# EAGLE design LPC_4TE_3.42taster2 (EAGLE 5.03)
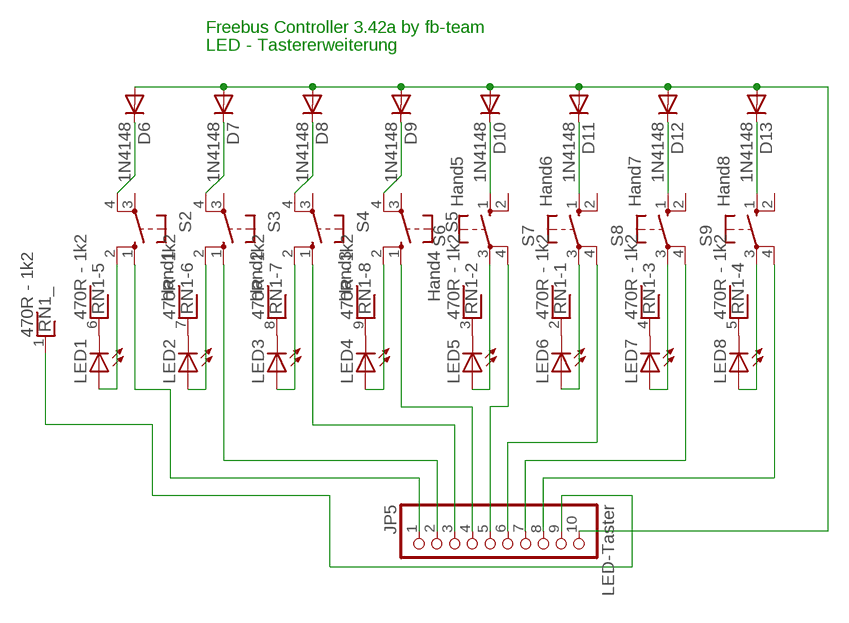
[diagram p0: schematic, sheet 1]

## Parts
D6  1N4148  [DO35-10]
D7  1N4148  [DO35-10]
D8  1N4148  [DO35-10]
D9  1N4148  [DO35-10]
D10  1N4148  [DO35-10]
D11  1N4148  [DO35-10]
D12  1N4148  [DO35-10]
D13  1N4148  [DO35-10]
JP5  LED-Taster  PINHD-1X10  [1X10]
LED1  LED3MM  [LED3MM]
LED2  LED3MM  [LED3MM]
LED3  LED3MM  [LED3MM]
LED4  LED3MM  [LED3MM]
LED5  LED3MM  [LED3MM]
LED6  LED3MM  [LED3MM]
LED7  LED3MM  [LED3MM]
LED8  LED3MM  [LED3MM]
RN1  470R - 1k2  RNX8  [RN-9]
S2  Hand1  10-XX  [B3F-10XX]
S3  Hand2  10-XX  [B3F-10XX]
S4  Hand3  10-XX  [B3F-10XX]
S5  Hand4  10-XX  [B3F-10XX]
S6  Hand5  10-XX  [B3F-10XX]
S7  Hand6  10-XX  [B3F-10XX]
S8  Hand7  10-XX  [B3F-10XX]
S9  Hand8  10-XX  [B3F-10XX]

## Nets
N$1: D6.C S2.4(P1)
N$2: JP5.8 S9.4(P1)
N$3: JP5.7 S8.4(P1)
N$4: D10.C S6.1(S)
N$5: D7.C S3.4(P1)
N$6: D8.C S4.4(P1)
N$7: D9.C S5.4(P1)
N$8: LED1.A S2.2(S1)
N$9: D11.C S7.1(S)
N$10: D12.C S8.1(S)
N$11: D13.C S9.1(S)
N$12: JP5.5 S6.4(P1)
N$13: LED5.K(C) RN1.3
N$14: LED6.K(C) RN1.2
N$15: LED1.K(C) RN1.6
N$16: LED7.K(C) RN1.4
N$17: LED8.K(C) RN1.5
N$18: LED4.K(C) RN1.9
N$19: LED2.K(C) RN1.7
N$20: LED3.K(C) RN1.8
N$21: JP5.6 S7.4(P1)
N$22: LED3.A S4.2(S1)
N$23: LED2.A S3.2(S1)
N$24: LED5.A S6.3(P)
N$25: JP5.9 RN1.1
N$26: LED6.A S7.3(P)
N$29: LED7.A S8.3(P)
N$30: LED8.A S9.3(P)
N$31: LED4.A S5.2(S1)
N$32: JP5.2 S3.1(S)
N$33: JP5.3 S4.1(S)
N$35: JP5.4 S5.1(S)
N$36: D6.A D7.A D8.A D9.A D10.A D11.A D12.A D13.A JP5.10
N$45: JP5.1 S2.1(S)
Unconnected: S2.3(P) S3.3(P) S4.3(P) S5.3(P) S6.2(S1) S7.2(S1) S8.2(S1) S9.2(S1)

## Notes on the sheet
- Freebus Controller 3.42a by fb-team
- LED - Tastererweiterung

## Library data of the parts
D6-D13 = diode:1N4148: DIODE high speed (Philips)
JP5 = pinhead:PINHD-1X10: PIN HEADER
LED1-LED8 = led:LED: LED OSRAM: - CHIPLED LG R971, LG N971, LY N971, LG Q971, LY Q971, LO R971, LY R971 LH N974, LH R974 LS Q976, LO Q976, LY Q976 LO Q996 - Hyper CHIPLED LW Q18S LB Q993, LB Q99A, LB R99A - SideLED LS A670, LO A670, LY A670, LG A670, LP A670 LB A673, LV A673, LT A673, LW A673 LH A674 LY A675 LS A676, LA A676, LO A676, LY A676, LW A676 LS A679, LY A679, LG A679 - Hyper Micro SIDELED® LS Y876, LA Y876, LO Y876, LY Y876 LT Y87S - SmartLED LW L88C, LW L88S LB L89C, LB L89S, LG L890 LS L89K, LO L89K, LY L89K LS L896, LA L896, LO L896, LY L896 - TOPLED LS T670, LO T670, LY T670, LG T670, LP T670 LSG T670, LSP T670, LSY T670, LOP T670, LYG T670 LG T671, LOG T671, LSG T671 LB T673, LV T673, LT T673, LW T673 LH T674 LS T676, LA T676, LO T676, LY T676, LB T676, LH T676, LSB T676, LW T676 LB T67C, LV T67C, LT T67C, LS T67K, LO T67K, LY T67K, LW E67C LS E67B, LA E67B, LO E67B, LY E67B, LB E67C, LV E67C, LT E67C LW T67C LS T679, LY T679, LG T679 LS T770, LO T770, LY T770, LG T770, LP T770 LB T773, LV T773, LT T773, LW T773 LH T774 LS E675, LA E675, LY E675, LS T675 LS T776, LA T776, LO T776, LY T776, LB T776 LHGB T686 LT T68C, LB T68C - Hyper Mini TOPLED® LB M676 - Mini TOPLED Santana® LG M470 LS M47K, LO M47K, LY M47K Source: http://www.osram.convergy.de - LUMILED® LXK2-PW12-R00, LXK2-PW12-S00, LXK2-PW14-U00, LXK2-PW14-V00 LXK2-PM12-R00, LXK2-PM12-S00, LXK2-PM14-U00 LXK2-PE12-Q00, LXK2-PE12-R00, LXK2-PE12-S00, LXK2-PE14-T00, LXK2-PE14-U00 LXK2-PB12-K00, LXK2-PB12-L00, LXK2-PB12-M00, LXK2-PB14-N00, LXK2-PB14-P00, LXK2-PB14-Q00 LXK2-PR12-L00, LXK2-PR12-M00, LXK2-PR14-Q00, LXK2-PR14-R00 LXK2-PD12-Q00, LXK2-PD12-R00, LXK2-PD12-S00 LXK2-PH12-R00, LXK2-PH12-S00 LXK2-PL12-P00, LXK2-PL12-Q00, LXK2-PL12-R00 Source: www.luxeon.com
RN1 = resistor-net:RNX8: RESISTOR NETWORK
S2-S9 = switch-omron:10-XX: OMRON SWITCH

## Board
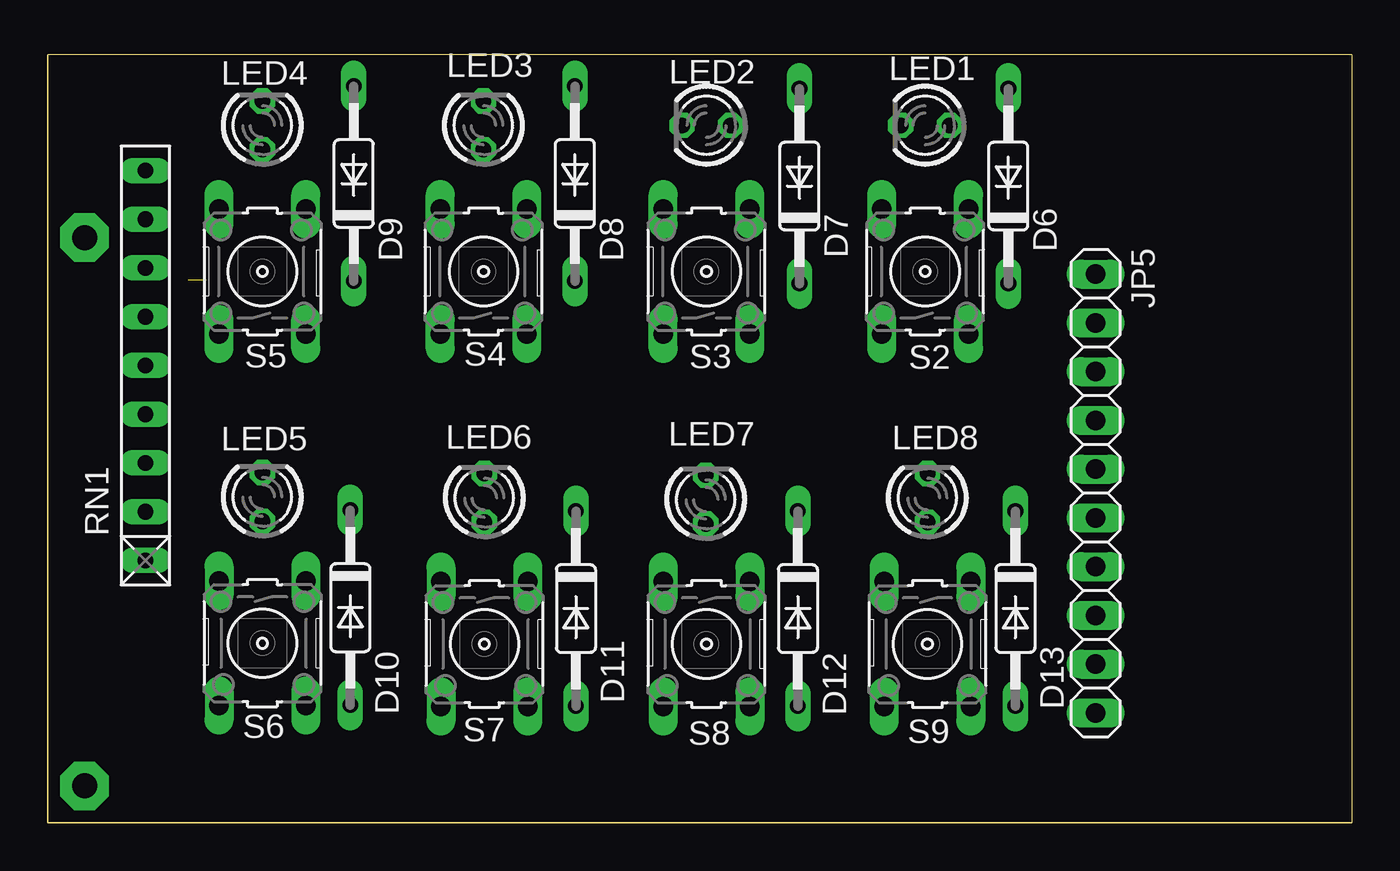
[diagram p1: board, top side]
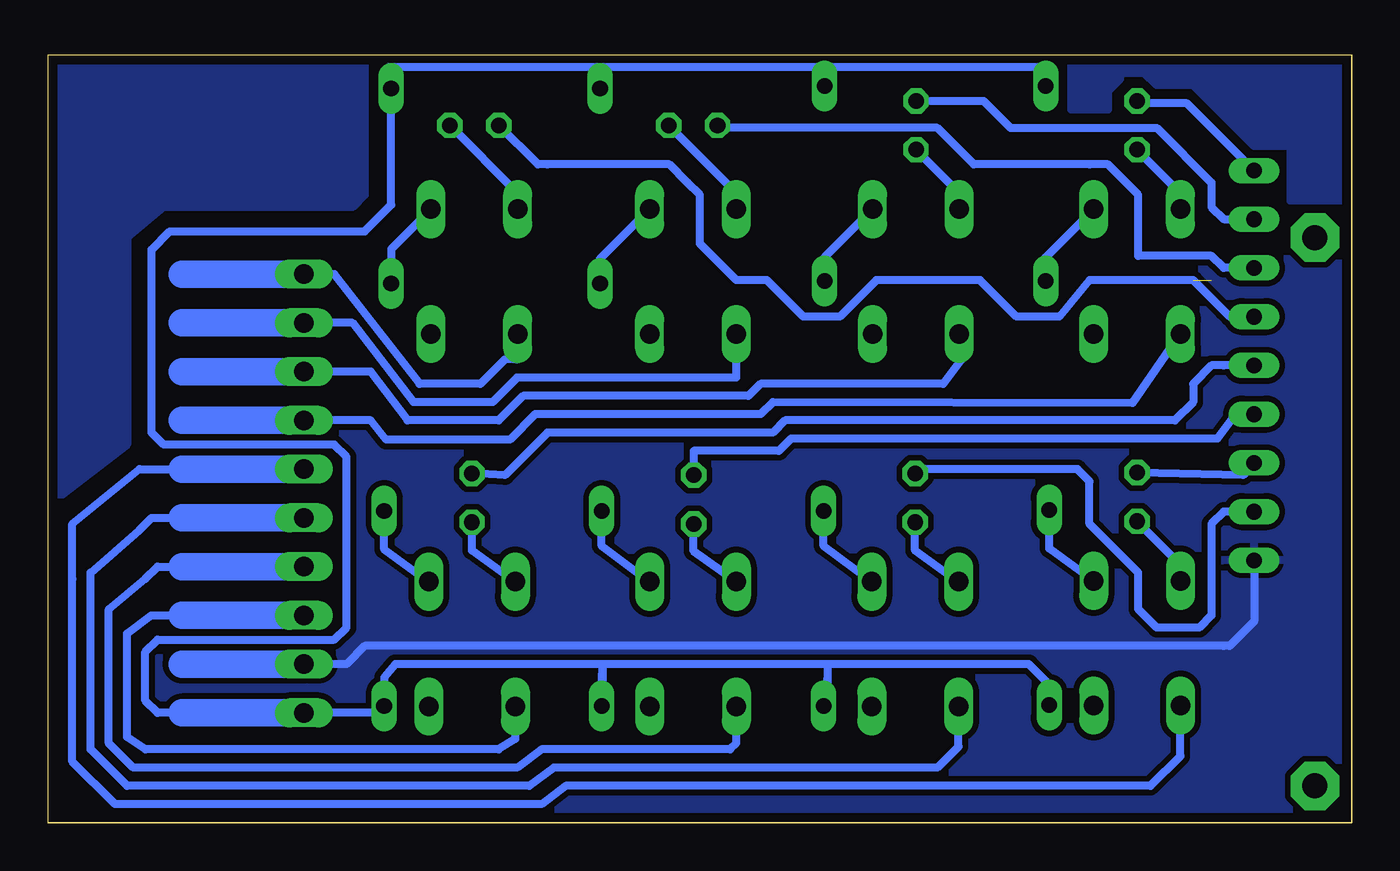
[diagram p2: board, bottom side, seen from below]

Size 67.94 x 40.01 mm. Coordinates in mm from the lower left corner, seen from the top.
Outline: 0,0 0,40.01
Outline: 67.94,0 67.94,40.01 0,40.01
Outline: 67.94,0 0,0
Outline: 0,40.01 0,0
Outline: 0,0 67.94,0
Copper layers (1*16): Top 0.035mm / dielectric 1.5mm / Bottom 0.035mm
Design rules "default *": minimum track width 10mil, minimum drill 24mil, track to track 12mil, track to pad 12mil, pad to pad 12mil, via to via 12mil, smd to smd 8mil, copper to edge 20mil, drill to drill 8mil, minimum pad ring 10mil, minimum via ring 8mil, stop-mask expansion 4mil, vias tented up to drill 0mil, thermal gap 10mil

### Footprints (pad centres in the part's own frame; a part is rotated, then mirrored left to right if it is on the bottom)
DO35-10 = drill 0.813 long: A 5.08,0; C -5.08,0
1X10 = drill 1.016 long: 1 -11.43,0; 2 -8.89,0; 3 -6.35,0; 4 -3.81,0; 5 -1.27,0; 6 1.27,0; 7 3.81,0; 8 6.35,0; 9 8.89,0; 10 11.43,0
LED3MM = drill 0.813 octagon: A -1.27,0; K 1.27,0
RN-9 = drill 0.813 long: 1 -10.16,0; 2 -7.62,0; 3 -5.08,0; 4 -2.54,0; 5 0,0; 6 2.54,0; 7 5.08,0; 8 7.62,0; 9 10.16,0
B3F-10XX = drill 1.016 long: 1 -3.251,2.261; 2 3.251,2.261; 3 -3.251,-2.261; 4 3.251,-2.261

### Placement (x,y rotation side)
D6  50.06,33.16 90 top
D7  39.17,33.16 90 top
D8  27.46,33.3 90 top
D9  15.94,33.3 90 top
D10  15.76,11.2 270 top
D11  27.51,11.15 270 top
D12  39.08,11.15 270 top
D13  50.42,11.15 270 top
JP5  54.61,17.14 270 top
LED1  45.72,36.33 180 top
LED2  34.32,36.33 180 top
LED3  22.7,36.33 90 top
LED4  11.18,36.33 90 top
LED5  11.18,16.96 90 top
LED6  22.75,16.92 90 top
LED7  34.29,16.83 90 top
LED8  45.84,16.92 90 top
RN1  5.08,23.81 90 top
S2  45.72,28.71 90 top
S3  34.32,28.71 90 top
S4  22.7,28.71 90 top
S5  11.18,28.71 90 top
S6  11.18,9.35 270 top
S7  22.75,9.3 270 top
S8  34.32,9.3 270 top
S9  45.84,9.3 270 top

### Tracks (layer width: path | path; a pad name or v marks a point on that pad's centre or on a via)
N$1
  Bottom 0.406: S2.4 50.06,29.88 D6.C
N$2
  Bottom 0.406: JP5.8 55.24,10.79 62.55,10.79 63.82,9.84 63.82,4.45 62.87,3.81 44.45,3.81 43.58,4.36 S9.4
N$3
  Bottom 0.406: JP5.7 62.23,13.34 62.87,12.7 64.77,11.11 64.77,4.13 63.5,2.86 43.5,2.86 42.23,3.81 32.38,3.81 32.06,4.14 S8.4
N$4
  Bottom 0.406: D10.C 15.76,14.28 S6.1
N$5
  Bottom 0.406: S3.4 39.17,29.37 D7.C
N$6
  Bottom 0.406: S4.4 27.46,29.46 D8.C
N$7
  Bottom 0.406: S5.4 15.94,29.46 D9.C
N$8
  Bottom 0.406: S2.2 43.46,32.8 LED1.A
N$9
  Bottom 0.406: S7.1 27.51,14.42 D11.C
N$10
  Bottom 0.406: S8.1 39.08,14.42 D12.C
N$11
  Bottom 0.406: S9.1 50.42,14.23 D13.C
N$12
  Bottom 0.406: JP5.5 63.18,18.41 66.67,15.56 66.67,12.7 66.67,3.17 64.45,0.95 42.23,0.95 40.96,1.91 10.48,1.91 8.92,3.46 S6.4
N$13
  Bottom 0.406: RN1.3 5.64,18.1 LED5.K
N$14
  Bottom 0.406: LED6.K 22.52,18.41 14.29,18.41 13.65,17.78 13.65,15.56 13.34,15.24 11.11,13.02 11.11,11.11 10.16,10.16 7.94,10.16 7.3,10.79 7.3,15.56 6.67,16.19 RN1.2
N$15  (1 unrouted)
  Bottom 0.406: LED1.K 42.41,34.29 41.91,34.29 35.56,34.29 34.61,33.34 33.97,32.7 33.97,30.16 32.07,28.26 30.48,28.26 28.57,26.35 26.67,26.35 24.77,28.26 19.37,28.26 17.46,26.35 17.14,26.35 15.24,26.35 13.65,28.26 8.26,28.26 6.67,26.67 6.35,26.35 RN1.6
N$16
  Bottom 0.406: LED7.K 34.29,19.37 29.84,19.37 29.21,20 14.29,20 8.26,20 6.99,20 6.03,21.27 RN1.4
N$17
  Bottom 0.406: LED8.K 44.13,18.1 41.91,20.32 30.16,20.32 29.53,20.95 9.21,20.95 8.26,21.91 8.26,22.86 7.3,23.81 6.67,23.81 RN1.5
N$18
  Bottom 0.406: RN1.9 8.57,37.47 11.05,37.47 LED4.K
N$19
  Bottom 0.406: LED2.K 32.92,36.2 21.59,36.2 19.68,34.29 13.65,34.29 12.7,34.29 11.11,32.7 11.11,29.53 7.3,29.53 6.67,28.89 RN1.7
N$20
  Bottom 0.406: LED3.K 19.18,37.6 17.78,36.2 10.16,36.2 7.3,33.34 7.3,32.07 6.67,31.43 RN1.8
N$21
  Bottom 0.406: JP5.6 62.55,15.88 63.18,15.24 65.72,13.02 65.72,3.81 63.82,1.91 42.86,1.91 41.59,2.86 21.59,2.86 20.49,3.96 S7.4
N$22
  Bottom 0.406: S4.2 20.44,32.8 LED3.A
N$23
  Bottom 0.406: S3.2 32.06,32.8 LED2.A
N$24
  Bottom 0.406: S6.3 8.92,13.43 LED5.A
N$25
  Bottom 0.406: JP5.9 52.39,8.26 51.44,9.21 6.67,9.21 6.35,9.21 5.08,10.48 RN1.1
  pour Bottom: 0,0 0,40.01 68,40.01 68,0
N$26
  Bottom 0.406: S7.3 22.75,14.17 LED6.A
N$27  (via drill 1.3 pad 2.54)
  other vias: 1.91,30.48
N$28  (via drill 1.3 pad 2.54)
  other vias: 1.91,1.91
N$29
  Bottom 0.406: S8.3 34.29,14.14 LED7.A
N$30
  Bottom 0.406: S9.3 45.84,14.17 LED8.A
N$31
  Bottom 0.406: LED4.A 8.92,32.8 S5.2
N$32
  Bottom 0.254: 32.07,25.4 S3.1
  Bottom 0.406: 32.07,25.4 32.07,23.18 40.64,23.18 43.5,23.18 44.77,21.91 48.9,21.91 52.07,26.04 JP5.2
N$33
  Bottom 0.406: JP5.3 51.12,23.5 49.21,20.95 44.45,20.95 43.18,22.23 31.43,22.23 30.8,22.86 21.27,22.86 20.32,24.13 S4.1
N$35
  Bottom 0.406: JP5.4 51.12,20.95 50.32,19.95 43.87,19.95 42.55,21.27 30.8,21.27 30.16,21.91 11.41,21.86 S5.1
N$36
  Bottom 0.406: D10.A 15.88,5.59 15.88,7.3 16.83,8.26 27.3,8.26 | 27.3,8.26 27.3,7.62 | 27.3,7.62 27.51,6.24 D11.A 27.3,5.64 27.3,7.62 | 27.3,8.26 27.3,7.62 | 27.3,8.26 39.05,8.26 | 39.05,8.26 39.08,7.59 D12.A 39.05,5.46 39.05,8.26 | 39.05,8.26 49.85,8.26 50.42,7.56 D13.A 50.39,5.71 JP5.10 62.23,5.71 62.87,6.35 62.87,8.89 62.23,9.53 53.02,9.53 52.39,10.16 52.39,19.05 53.02,19.68 61.91,19.68 62.55,20.32 62.55,29.84 61.59,30.8 51.44,30.8 50.06,32.17 D6.A 50.16,38.35 50.16,39.37 39.05,39.37 | 39.05,39.37 39.17,39.25 D7.A 39.05,38.36 39.05,39.37 | 39.05,39.37 27.62,39.37 27.46,39.21 D8.A 27.3,38.53 27.3,39.37 15.88,39.37 15.94,39.3 D9.A
N$37
  pour Bottom: 51.44,40.01 51.44,32.7 52.07,32.07 61.91,32.07 63.82,30.48 63.82,19.68 67.94,16.51 67.94,40.01
N$38
  pour Bottom: 0,32.38 3.17,32.38 3.17,35.24 5.08,35.24 8.26,38.42 9.53,38.42 9.53,40.01 0.32,40.01 0,39.69
N$39
  pour Bottom: 9.53,38.42 10.16,38.42 10.79,39.05 12.06,39.05 12.06,38.73 12.38,38.42 12.7,38.1 12.7,37.15 14.61,37.15 14.61,40.01 9.53,40.01
N$45
  Bottom 0.406: JP5.1 53.02,28.57 48.58,22.86 45.4,22.86 44.13,24.13 43.5,24.13 S2.1
  Bottom 1.422: JP5.1 60.96,28.57 | 54.61,26.04 60.96,26.04 | 54.61,23.5 60.96,23.5 | 54.61,20.95 60.96,20.95 | 54.61,18.41 60.96,18.41 | 54.61,15.88 60.96,15.88 | 54.61,13.34 60.96,13.34 | 54.61,10.79 60.96,10.79 | 54.61,8.26 60.96,8.26 | 54.61,5.71 60.96,5.71